# EAGLE design EurorackWizard (EAGLE 7.6.0)
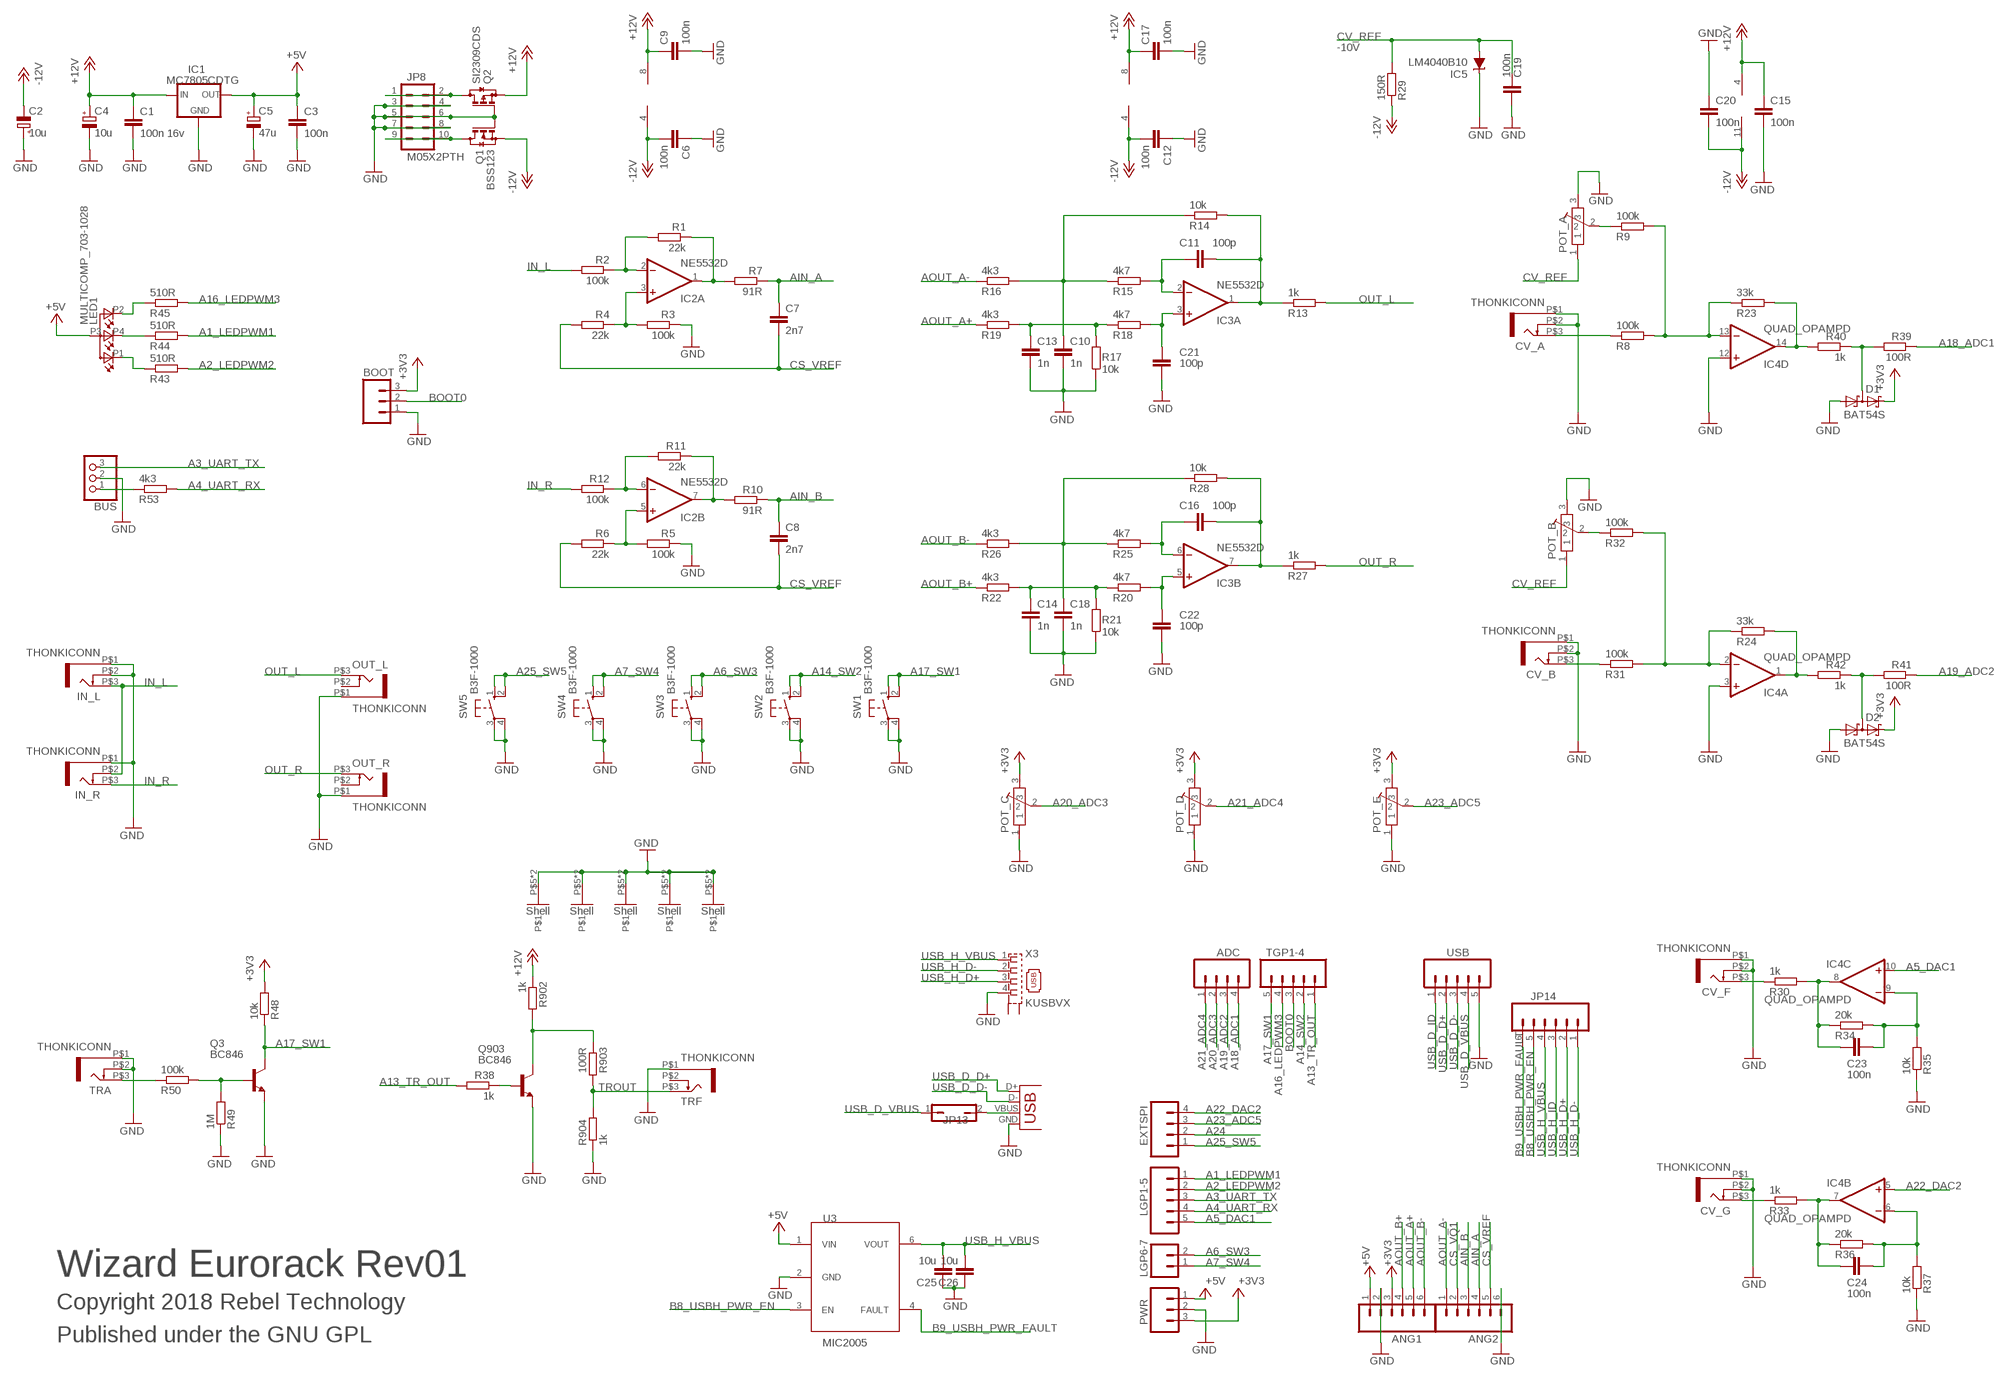
[diagram p0: schematic, sheet 1]

## Parts
ADC  M04PTH  [1X04]
ANG1  M06SIP  [1X06]
ANG2  M06SIP  [1X06]
BOOT  M03PTH  [1X03]
BUS  CON-JST-1X03PH-TH  [JST-B3B-PH-KL]
C1  100n 16v  C-EUC0603  [C0603]
C2  10u  CPOL-EU153CLV-0505  [CPOL-5]
C3  100n  C-EUC0603  [C0603]
C4  10u  CPOL-EU153CLV-0505  [CPOL-5]
C5  47u  CPOL-EUB  [PANASONIC_B]
C6  100n  C-EUC0603  [C0603]
C7  2n7  C-EUC0603  [C0603]
C8  2n7  C-EUC0603  [C0603]
C9  100n  C-EUC0603  [C0603]
C10  1n  C-EUC0603  [C0603]
C11  100p  C-EUC0603  [C0603]
C12  100n  C-EUC0603  [C0603]
C13  1n  C-EUC0603  [C0603]
C14  1n  C-EUC0603  [C0603]
C15  100n  C-EUC0603  [C0603]
C16  100p  C-EUC0603  [C0603]
C17  100n  C-EUC0603  [C0603]
C18  1n  C-EUC0603  [C0603]
C19  100n  C-EUC0603  [C0603]
C20  100n  C-EUC0603  [C0603]
C21  100p  C-EUC0603  [C0603]
C22  100p  C-EUC0603  [C0603]
C23  100n  C-EUC0603  [C0603]
C24  100n  C-EUC0603  [C0603]
C25  10u  C-EUC0603  [C0603]
C26  10u  C-EUC0603  [C0603]
CV_A  THONKICONN  [THONKICONN]
CV_B  THONKICONN  [THONKICONN]
CV_F  THONKICONN  [THONKICONN]
CV_G  THONKICONN  [THONKICONN]
D1  BAT54S  [SOT23]
D2  BAT54S  [SOT23]
EXTSPI  M04PTH  [1X04]
IC1  MC7805CDTG  MC78XX  [DPACK]
IC2  NE5532D  [SO08]
IC3  NE5532D  [SO08]
IC4  QUAD_OPAMPD  [SO14]
IC5  LM4040B10  LM4041C12DBZ  [DBZ_R-PDSO-G3]
IN_L  THONKICONN  [THONKICONN]
IN_R  THONKICONN  [THONKICONN]
JP8  M05X2PTH  [AVR_ICSP]
JP13  JP1Q  [JP1]
JP14  M06SIP  [1X06]
LED1  MULTICOMP_703-1028  [RGB-LED-703-1028]
LGP1-5  M05PTH  [1X05]
LGP6-7  M02PTH  [1X02]
OUT_L  THONKICONN  [THONKICONN]
OUT_R  THONKICONN  [THONKICONN]
POT_A  POT-ALPS-RK09L1140  [POT-ALPS-RK09L1140]
POT_B  POT-ALPS-RK09L1140  [POT-ALPS-RK09L1140]
POT_C  POT-ALPS-RK09L1140  [POT-ALPS-RK09L1140]
POT_D  POT-ALPS-RK09L1140  [POT-ALPS-RK09L1140]
POT_E  POT-ALPS-RK09L1140  [POT-ALPS-RK09L1140]
PWR  M03PTH  [1X03]
Q1  BSS123  [SOT23]
Q2  SI2309CDS  BSS84  [SOT23]
Q3  BC846  [SOT23]
Q903  BC846  [SOT23]
R1  22k  R-EU_0603  [0603]
R2  100k  R-EU_0603  [0603]
R3  100k  R-EU_0603  [0603]
R4  22k  R-EU_0603  [0603]
R5  100k  R-EU_0603  [0603]
R6  22k  R-EU_0603  [0603]
R7  91R  R-EU_0603  [0603]
R8  100k  R-EU_0603  [0603]
R9  100k  R-EU_0603  [0603]
R10  91R  R-EU_0603  [0603]
R11  22k  R-EU_0603  [0603]
R12  100k  R-EU_0603  [0603]
R13  1k  R-EU_0603  [0603]
R14  10k  R-EU_0603  [0603]
R15  4k7  R-EU_0603  [0603]
R16  4k3  R-EU_0603  [0603]
R17  10k  R-EU_0603  [0603]
R18  4k7  R-EU_0603  [0603]
R19  4k3  R-EU_0603  [0603]
R20  4k7  R-EU_0603  [0603]
R21  10k  R-EU_0603  [0603]
R22  4k3  R-EU_0603  [0603]
R23  33k  R-EU_0603  [0603]
R24  33k  R-EU_0603  [0603]
R25  4k7  R-EU_0603  [0603]
R26  4k3  R-EU_0603  [0603]
R27  1k  R-EU_0603  [0603]
R28  10k  R-EU_0603  [0603]
R29  150R  R-EU_0603  [0603]
R30  1k  R-EU_0603  [0603]
R31  100k  R-EU_0603  [0603]
R32  100k  R-EU_0603  [0603]
R33  1k  R-EU_0603  [0603]
R34  20k  R-EU_0603  [0603]
R35  10k  R-EU_0603  [0603]
R36  20k  R-EU_0603  [0603]
R37  10k  R-EU_0603  [0603]
R38  1k  R-EU_0603  [0603]
R39  100R  R-EU_0603  [0603]
R40  1k  R-EU_0603  [0603]
R41  100R  R-EU_0603  [0603]
R42  1k  R-EU_0603  [0603]
R43  510R  R-EU_0603  [0603]
R44  510R  R-EU_0603  [0603]
R45  510R  R-EU_0603  [0603]
R48  10k  R-EU_0603  [0603]
R49  1M  R-EU_0603  [0603]
R50  100k  R-EU_0603  [0603]
R53  4k3  R-EU_0603  [0603]
R902  1k  R-EU_0603  [0603]
R903  100R  R-EU_0603  [0603]
R904  1k  R-EU_0603  [0603]
SW1  B3F-1000  10-XX  [B3F-10XX]
SW2  B3F-1000  10-XX  [B3F-10XX]
SW3  B3F-1000  10-XX  [B3F-10XX]
SW4  B3F-1000  10-XX  [B3F-10XX]
SW5  B3F-1000  10-XX  [B3F-10XX]
TGP1-4  M05PTH  [1X05]
TRA  THONKICONN  [THONKICONN]
TRF  THONKICONN  [THONKICONN]
U3  MIC2005  [SOT23-6]
USB  M05PTH  [1X05]
X3  KUSBVX  [KUSBVX]
X5  USBPTH-VERTICAL  [USB-B-PTH-VERTICAL]

## Nets
+3V3: ANG1.3 BOOT.3 D1.2(C2) D2.2(C2) POT_C.3 POT_D.3 POT_E.3 PWR.3 R48.2
+5V: ANG1.1 C3.1 C5.+ IC1.3(OUT) LED1.P3(A) PWR.1 U3.1(VIN)
+12V: C1.1 C4.+ C9.1 C15.1 C17.1 IC1.1(IN) IC2.8(P:V+) IC3.8(P:V+) IC4.4(P:V+) Q2.2(S) R902.1
-12V: C2.- C6.2 C12.2 C20.2 IC2.4(P:V-) IC3.4(P:V-) IC4.11(P:V-) Q1.2(S) R29.1
A1_LEDPWM1: LGP1-5.1 R44.2
A2_LEDPWM2: LGP1-5.2 R43.2
A3_UART_TX: BUS.3 LGP1-5.3
A4_UART_RX: LGP1-5.4 R53.2
A5_DAC1: IC4.10(C:+IN) LGP1-5.5
A6_SW3: LGP6-7.2 SW3.1(S) SW3.2(S1)
A7_SW4: LGP6-7.1 SW4.1(S) SW4.2(S1)
A13_TR_OUT: R38.2 TGP1-4.1
A14_SW2: SW2.1(S) SW2.2(S1) TGP1-4.2
A16_LEDPWM3: R45.2 TGP1-4.4
A17_SW1: Q3.3(C) R48.1 SW1.1(S) SW1.2(S1) TGP1-4.5
A18_ADC1: ADC.4 R39.1
A19_ADC2: ADC.3 R41.1
A20_ADC3: ADC.2 POT_C.2
A21_ADC4: ADC.1 POT_D.2
A22_DAC2: EXTSPI.4 IC4.5(B:+IN)
A23_ADC5: EXTSPI.3 POT_E.2
A24: EXTSPI.2
A25_SW5: EXTSPI.1 SW5.1(S) SW5.2(S1)
AIN_A: ANG2.4 C7.1 R7.1
AIN_B: ANG2.3 C8.1 R10.1
AOUT_A+: ANG1.5 R19.1
AOUT_A-: ANG2.1 R16.1
AOUT_B+: ANG1.4 R22.1
AOUT_B-: ANG1.6 R26.1
B8_USBH_PWR_EN: JP14.5 U3.3(EN)
B9_USBH_PWR_FAULT: JP14.6 U3.4(FAULT)
BOOT0: BOOT.2 TGP1-4.3
CS_VQ1: ANG2.2
CS_VREF: ANG2.5 C7.2 C8.2 R4.2 R6.2
CV_REF: C19.1 IC5.2(A) POT_A.1 POT_B.1 R29.2
EXT_UART_RX: BUS.1 R53.1
GND: ANG1.2 ANG2.6 BOOT.1 BUS.2 C1.2 C2.+ C3.2 C4.- C5.- C6.1 C9.2 C10.2 C12.1 C13.2 C14.2 C15.2 C17.2 C18.2 C19.2 C20.1 C21.2 C22.2 C25.1 C26.1 CV_A.P$1 CV_A.P$2 CV_B.P$1 CV_B.P$2 CV_F.P$1 CV_F.P$2 CV_G.P$1 CV_G.P$2 D1.1(A1) D2.1(A1) IC1.4(GND) IC4.3(A:+IN) IC4.12(D:+IN) IC5.1(C) IN_L.P$1 IN_L.P$2 IN_R.P$1 JP8.3 JP8.4 JP8.5 JP8.6 JP8.7 JP8.8 OUT_L.P$1 OUT_R.P$1 POT_A.3 POT_A.P$5 POT_A.P$6 POT_B.3 POT_B.P$5 POT_B.P$6 POT_C.1 POT_C.P$5 POT_C.P$6 POT_D.1 POT_D.P$5 POT_D.P$6 POT_E.1 POT_E.P$5 POT_E.P$6 PWR.2 Q1.1(G) Q2.1(G) Q3.2(E) Q903.2(E) R3.1 R5.1 R17.1 R21.1 R35.1 R37.1 R49.1 R904.1 SW1.3(P) SW1.4(P1) SW2.3(P) SW2.4(P1) SW3.3(P) SW3.4(P1) SW4.3(P) SW4.4(P1) SW5.3(P) SW5.4(P1) TRA.P$1 TRA.P$2 TRF.P$1 U3.2(GND) USB.5 X3.4 X5.GND
IN_L: IN_L.P$3 IN_R.P$2 R2.2
IN_R: IN_R.P$3 R12.2
N$1: IC2.1(A:OUT) R1.1 R7.2
N$2: IC2.3(A:+IN) R3.2 R4.1
N$3: CV_A.P$3 R8.1
N$4: IC2.5(B:+IN) R5.2 R6.1
N$5: IC2.6(B:-IN) R11.2 R12.1
N$6: CV_F.P$3 R30.1
N$7: C11.1 IC3.2(A:-IN) R15.2
N$8: JP8.9 JP8.10 Q1.3(D)
N$9: IC2.2(A:-IN) R1.2 R2.1
N$10: IC2.7(B:OUT) R10.2 R11.1
N$11: C21.1 IC3.3(A:+IN) R18.2
N$12: JP8.1 JP8.2 Q2.3(D)
N$13: IC4.13(D:-IN) R8.2 R9.2 R23.1
N$14: POT_A.2 R9.1
N$15: C13.1 R17.2 R18.1 R19.2
N$16: D1.3(C1A2) R39.2 R40.1
N$17: IC4.14(D:OUT) R23.2 R40.2
N$18: C16.2 IC3.7(B:OUT) R27.1 R28.2
N$19: CV_B.P$3 R31.1
N$20: IC4.2(A:-IN) R24.1 R31.2 R32.2
N$21: POT_B.2 R32.1
N$22: IC4.1(A:OUT) R24.2 R42.2
N$23: D2.3(C1A2) R41.2 R42.1
N$24: C18.1 R25.1 R26.2 R28.1
N$25: C23.2 IC4.8(C:OUT) R30.2 R34.1
N$26: C16.1 IC3.6(B:-IN) R25.2
N$27: JP13.2 X5.VBUS
N$28: CV_G.P$3 R33.1
N$29: C23.1 IC4.9(C:-IN) R34.2 R35.2
N$30: C22.1 IC3.5(B:+IN) R20.2
N$31: C24.2 IC4.7(B:OUT) R33.2 R36.1
N$32: C14.1 R20.1 R21.2 R22.2
N$33: C24.1 IC4.6(B:-IN) R36.2 R37.2
N$37: Q3.1(B) R49.2 R50.2
N$39: C11.2 IC3.1(A:OUT) R13.1 R14.2
N$40: LED1.P1(CRED) R43.1
N$41: C10.1 R14.1 R15.1 R16.2
N$42: LED1.P2(CGREEN) R45.1
N$43: LED1.P4(CBLUE) R44.1
N$46: R50.1 TRA.P$3
N$47: Q903.1(B) R38.1
N$51: Q903.3(C) R902.2 R903.1
OUT_L: OUT_L.P$3 R13.2
OUT_R: OUT_R.P$3 R27.2
TROUT: R903.2 R904.2 TRF.P$3
USB_D_D+: USB.2 X5.D+
USB_D_D-: USB.3 X5.D-
USB_D_ID: USB.1
USB_D_VBUS: JP13.1 USB.4
USB_H_D+: JP14.2 X3.3
USB_H_D-: JP14.1 X3.2
USB_H_ID: JP14.3
USB_H_VBUS: C25.2 C26.2 JP14.4 U3.6(VOUT) X3.1
Unconnected: OUT_L.P$2 OUT_R.P$2 TRF.P$2 X3.M1(S1) X3.M2(S2)

## Notes on the sheet
- -10V
- Wizard Eurorack Rev01
- Copyright 2018 Rebel Technology
- Published under the GNU GPL

## Library data of the parts
ADC EXTSPI = SparkFun:M04: Header 4 Standard 4-pin 0.1" header. Use with straight break away headers (SKU : PRT-00116), right angle break away headers (PRT-00553), swiss pins (PRT-00743), machine pins (PRT-00117), and female headers (PRT-00115). Molex polarized connector foot print use with SKU : PRT-08231 with associated crimp pins and housings. 1MM SMD Version SKU: PRT-10208
ANG1 ANG2 JP14 = SparkFun:M06: Header 6 Standard 6-pin 0.1" header. Use with straight break away headers (SKU : PRT-00116), right angle break away headers (PRT-00553), swiss pins (PRT-00743), machine pins (PRT-00117), and female headers (PRT-00115). Molex polarized connector foot print use with SKU : PRT-08094 with associated crimp pins and housings. NOTES ON THE VARIANTS LOCK and LOCK_LONGPADS... This footprint was designed to help hold the alignment of a through-hole component (i.e. 6-pin header) while soldering it into place. You may notice that each hole has been shifted either up or down by 0.005 of an inch from it's more standard position (which is a perfectly straight line). This slight alteration caused the pins (the squares in the middle) to touch the edges of the holes. Because they are alternating, it causes a "brace" to hold the component in place. 0.005 has proven to be the perfect amount of "off-center" position when using our standard breakaway headers. Although looks a little odd when you look at the bare footprint, once you have a header in there, the alteration is very hard to notice. Also, if you push a header all the way into place, it is covered up entirely on the bottom side. This idea of altering the position of holes to aid alignment will be further integrated into the Sparkfun Library for other footprints. It can help hold any component with 3 or more connection pins.
BOOT PWR = SparkFun:M03: Header 3 Standard 3-pin 0.1" header. Use with straight break away headers (SKU : PRT-00116), right angle break away headers (PRT-00553), swiss pins (PRT-00743), machine pins (PRT-00117), and female headers (PRT-00115). Molex polarized connector foot print use with SKU : PRT-08232 with associated crimp pins and housings.
BUS = Rebel:CON-JST-1X03
C1 C3 C23 C24 = Rebel:C-EU: CAPACITOR, European symbol
C2 C4 = Rebel:CPOL-EU: POLARIZED CAPACITOR, European symbol
C5 = rcl:CPOL-EU: POLARIZED CAPACITOR, European symbol
C6-C22 C25 C26 = resistor:C-EU: CAPACITOR, European symbol
CV_A CV_B CV_F CV_G IN_L IN_R OUT_L OUT_R TRA TRF = Rebel:THONKICONN
D1 D2 = diode:BAT54S: Schottky Diodes Pin connection corrected 2011-05-04 Source: Fairchild .. BAT54.pdf
IC1 = James:MC78XX: VOLTAGE REGULATOR; OC_FARNELL: 2296028
IC2 IC3 = linear:NE5532: AUDIO AMPLIFIER
IC4 = adafruit:QUAD_OPAMP: OP AMP Standard quad package
IC5 = texas:LM4041: PRECISION MICROPOWER SHUNT VOLTAGE REFERENCE Source: http://focus.ti.com/lit/ds/slcs146e/slcs146e.pdf; MF: TEXAS INSTRUMENT CONNECTORS; MPN: LM4041C12QDBZT; OC_FARNELL: 1771733; OC_NEWARK: 43K3376
JP8 = SparkFun:M05X2: Header 5x2 Standard 10-pin dual row 0.1" header. Commonly used with AVR-ISP. Use with Spark Fun Electronics SKU: PRT-00778
JP13 = jumper:JP1Q: JUMPER
LED1 = Rebel:MULTICOMP_703-1028: Farnell: 2112143
LGP1-5 TGP1-4 USB = SparkFun:M05: Header 5 Standard 5-pin 0.1" header. Use with straight break away headers (SKU : PRT-00116), right angle break away headers (PRT-00553), swiss pins (PRT-00743), machine pins (PRT-00117), and female headers (PRT-00115). Molex polarized connector foot print use with SKU : PRT-08230 with associated crimp pins and housings.
LGP6-7 = SparkFun:M02: Header 2 Standard 2-pin 0.1" header. Use with straight break away headers (SKU : PRT-00116), right angle break away headers (PRT-00553), swiss pins (PRT-00743), machine pins (PRT-00117), and female headers (PRT-00115). Molex polarized connector foot print use with SKU : PRT-08233 with associated crimp pins and housings.
POT_A POT_B POT_C POT_D POT_E = Rebel:POT-ALPS-RK09L
Q1 = transistor-small-signal:BSS123: N-CHANNEL MOS FET; OC_FARNELL: 1843725
Q2 = transistor-small-signal:BSS84: P-CHANNEL MOS FET; OC_FARNELL: 1779264
Q3 Q903 = transistor:BC846: NPN TRANSISTOR
R1-R45 R48-R50 R53 R902-R904 = Rebel:R-EU_: RESISTOR, European symbol
SW1-SW5 = switch-omron:10-XX: OMRON SWITCH; MPN: B3F-1000; OC_FARNELL: 176432; OC_NEWARK: 36M3542
U3 = James:MIC2005; OC_FARNELL: 2509882
X3 = con-kycon:KUSBVX: Vertical,Top Entry Universal Serial Bus Connector KUSBVX Series Source: KYCON Sibalco USB vertical socket KUSBV.pdf
X5 = SparkFun:USB: USB Connectors USB-B-PTH is fully proven SKU : PRT-00139 USB-miniB is fully proven SKU : PRT-00587 USB-A-PCB is untested. USB-A-H is throughly reviewed, but untested. Spark Fun Electronics SKU : PRT-00437 USB-B-SMT is throughly reviewed, but untested. Needs silkscreen touching up. USB-A-S has not been used/tested USB-MB-H has not been used/tested

## Net classes
1 power: width 0.178 mm, drill 0.305 mm, clearance 0.178 mm to class 0, clearance 0.178 mm

## Board
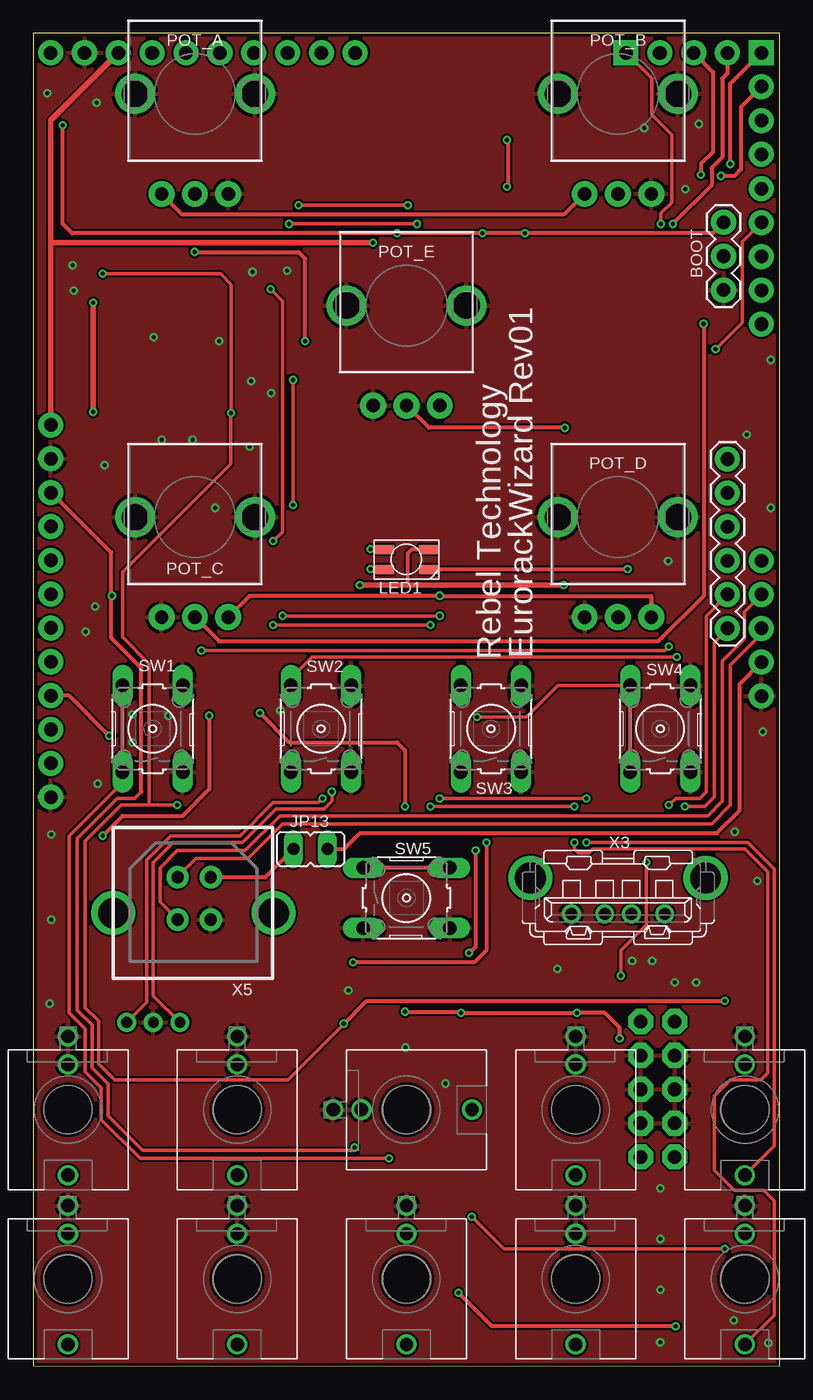
[diagram p1: board, top side]
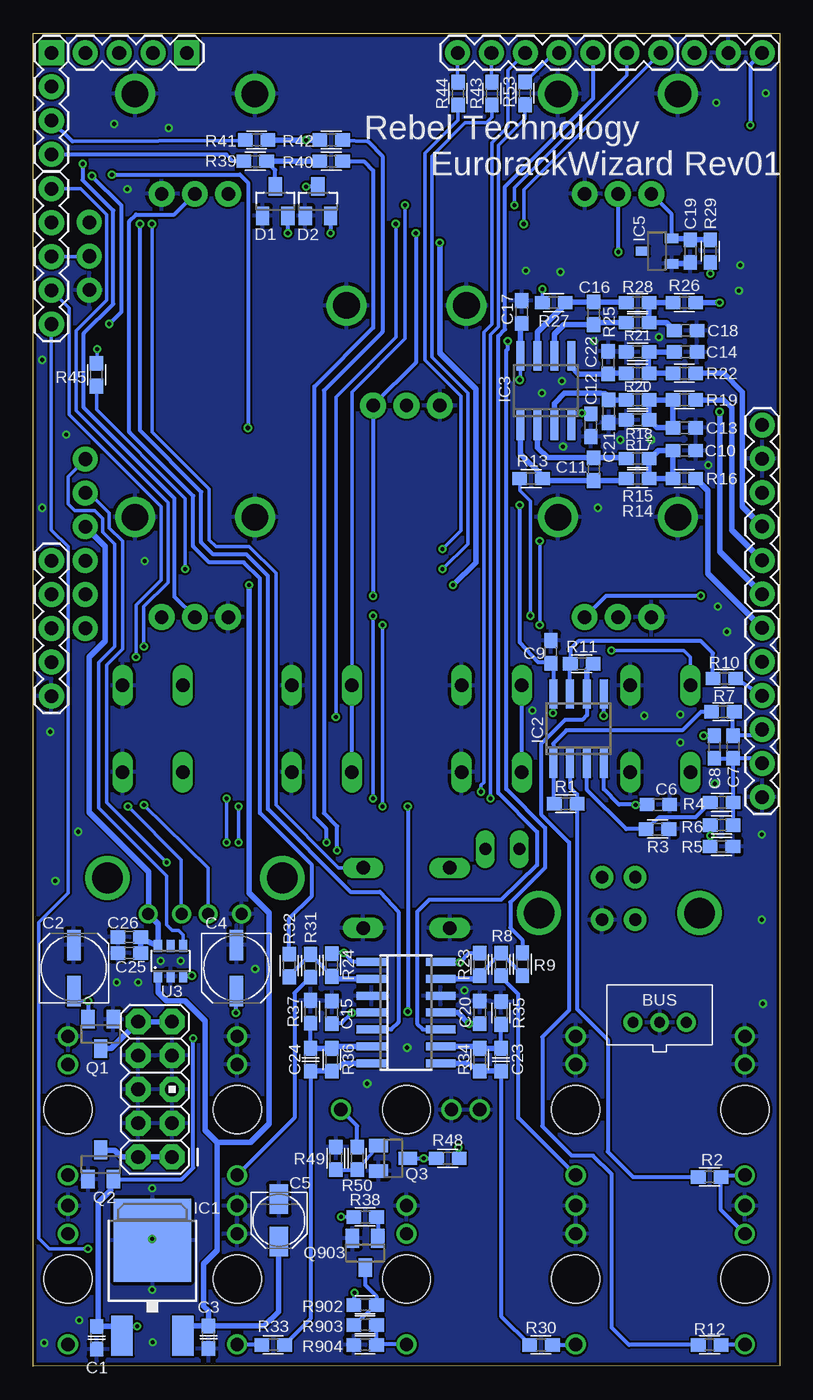
[diagram p2: board, bottom side, seen from below]

Size 56 x 100 mm. Coordinates in mm from the lower left corner, seen from the top.
Outline: 0,0.03 56,0 56,100 0,100 0,0.03
Copper layers (1*16): Top 0.035mm / dielectric 1.5mm / Bottom 0.035mm
Design rules "SeeedStudio_2layer_DRU_no_angle_20140221": minimum track width 6mil, minimum drill 12mil, track to track 6mil, track to pad 6mil, pad to pad 6mil, via to via 6mil, smd to smd 0mil, copper to edge 10mil, drill to drill 10mil, minimum pad ring 10mil, minimum via ring 6mil, stop-mask expansion 2mil, vias tented up to drill 100mil, thermal gap 10mil

### Footprints (pad centres in the part's own frame; a part is rotated, then mirrored left to right if it is on the bottom)
1X04 = drill 1.016 pad 1.88 square: 1 0,0 | drill 1.016 pad 1.88: 2 2.54,0; 3 5.08,0; 4 7.62,0
1X06 = drill 1.016 pad 1.88: 1 0,0; 2 2.54,0; 3 5.08,0; 4 7.62,0; 5 10.16,0; 6 12.7,0
1X03 = drill 1.016 pad 1.88: 1 0,0; 2 2.54,0; 3 5.08,0
JST-B3B-PH-KL = drill 0.8 pad 1.422: 1 2,0; 2 0,0; 3 -2,0
C0603 = smd 1.1 x 1: 1 -0.85,0; 2 0.85,0
CPOL-5 = smd 2.3 x 1: + 1.725,0; - -1.725,0
PANASONIC_B = smd 2.2 x 1.4: + 1.6,0; - -1.6,0
THONKICONN = drill 1: P$1 0,-5.5; P$2 0,-3.38; P$3 0,4.92 | hole 3.6: 0,0
SOT23 = smd 1 x 1.4: 1 -0.95,-1.1; 2 0.95,-1.1; 3 0,1.1
DPACK = smd 1.6 x 3: 1 -2.28,-4.8; 3 2.28,-4.8 | smd 5.8 x 6.2: 4 0,2.38
SO08 = smd 0.6 x 2.2: 1 -1.905,-2.6; 2 -0.635,-2.6; 3 0.635,-2.6; 4 1.905,-2.6; 5 1.905,2.6; 6 0.635,2.6; 7 -0.635,2.6; 8 -1.905,2.6
SO14 = smd 0.6 x 2.2: 1 -3.81,-2.6; 2 -2.54,-2.6; 3 -1.27,-2.6; 4 0,-2.6; 5 1.27,-2.6; 6 2.54,-2.6; 7 3.81,-2.6; 8 3.81,2.6; 9 2.54,2.6; 10 1.27,2.6; 11 0,2.6; 12 -1.27,2.6; 13 -2.54,2.6; 14 -3.81,2.6
DBZ_R-PDSO-G3 = smd 0.7 x 1: 1 -0.95,-1.1; 2 0.95,-1.1; 3 0,1.1
AVR_ICSP = drill 1.016 pad 1.88 octagon: 1 -1.27,5.08; 2 1.27,5.08; 3 -1.27,2.54; 4 1.27,2.54; 5 -1.27,0; 6 1.27,0; 7 -1.27,-2.54; 8 1.27,-2.54; 9 -1.27,-5.08; 10 1.27,-5.08
JP1 = drill 0.914 long: 1 0,-1.27; 2 0,1.27
RGB-LED-703-1028 = smd 0.7 x 1.4: P1 -0.75,1.65; P2 -0.75,-1.65; P3 0.75,-1.65; P4 0.75,1.65
1X05 = drill 1.016 pad 1.88: 1 0,0; 2 2.54,0; 3 5.08,0; 4 7.62,0; 5 10.16,0
1X02 = drill 1.016 pad 1.88: 1 0,0; 2 2.54,0
POT-ALPS-RK09L1140 = drill 1 pad 1.93: 1 -2.5,-7.5; 2 0,-7.5; 3 2.5,-7.5 | drill 2: P$5 -4.5,0; P$6 4.5,0
0603 = smd 1.1 x 1: 1 -0.85,0; 2 0.85,0
B3F-10XX = drill 1.016 long: 1 -3.251,2.261; 2 3.251,2.261; 3 -3.251,-2.261; 4 3.251,-2.261
SOT23-6 = smd 0.6 x 0.9: 1 -0.95,-1.15; 2 0,-1.15; 3 0.95,-1.15; 4 0.95,1.15; 5 0,1.15; 6 -0.95,1.15
KUSBVX = drill 0.9 pad 1.3: 1 3.5,0; 2 1,0; 3 -1,0; 4 -3.5,0 | drill 2.3 pad 2.8: M1 -6.57,2.71; M2 6.57,2.71
USB-B-PTH-VERTICAL = drill 0.914 pad 1.676: D+ 4.826,4.394; D- 4.826,7.595; GND 7.315,4.394; VBUS 7.315,7.595 | drill 2.286: P$1 0,4.902; P$2 12.04,4.902

### Placement (x,y rotation side)
ADC  54.64,98.54 270 bottom
ANG1  1.31,70.62 270 bottom
ANG2  1.31,55.39 270 bottom
BOOT  51.8,80.74 90 top
BUS  9,25.8 0 bottom
C1  51.24,2.13 270 bottom
C2  52.96,29.87 90 bottom
C3  42.86,2.17 270 bottom
C4  40.76,29.87 270 bottom
C5  37.57,10.94 270 bottom
C6  9.1,42.14 180 bottom
C7  3.5,46.46 270 bottom
C8  4.9,46.46 270 bottom
C9  17.16,53.6 90 bottom
C10  7.14,68.7 0 bottom
C11  13.94,67.3 270 bottom
C12  14.16,70.6 90 bottom
C13  7.14,70.4 0 bottom
C14  7.04,76.1 0 bottom
C15  33.6,26.54 90 bottom
C16  13.94,79 90 bottom
C17  19.34,79.1 90 bottom
C18  7.04,77.7 0 bottom
C19  6.7,83.66 270 bottom
C20  22.5,26.54 270 bottom
C21  12.82,71.64 270 bottom
C22  12.86,75.29 90 bottom
C23  20.9,23 270 bottom
C24  35.2,23 270 bottom
C25  48.8,31 0 bottom
C26  48.8,32.2 0 bottom
CV_A  15.3,19.25 180 top
CV_B  40.7,19.25 180 top
CV_F  15.3,6.55 180 top
CV_G  40.7,6.55 180 top
D1  37.84,87.4 0 bottom
D2  34.64,87.4 0 bottom
EXTSPI  44.48,98.54 180 bottom
IC1  47.06,7.07 0 bottom
IC2  15.08,47.83 0 bottom
IC3  17.54,73.2 0 bottom
IC4  28.03,26.53 270 bottom
IC5  9.2,83.66 90 bottom
IN_L  2.6,19.25 180 top
IN_R  2.6,6.55 180 top
JP8  46.86,20.77 180 bottom
JP13  20.8,38.8 90 top
JP14  52.1,55.36 90 top
LED1  28,60.52 90 top
LGP1-5  24.16,98.54 0 bottom
LGP6-7  8.92,98.54 180 bottom
OUT_L  53.4,19.25 180 top
OUT_R  53.4,6.55 180 top
POT_A  12.12,95.45 0 top
POT_B  43.88,95.45 0 top
POT_C  12.12,63.7 0 top
POT_D  43.88,63.7 0 top
POT_E  28,79.58 0 top
PWR  6.38,98.54 0 bottom
Q1  50.94,24.93 180 bottom
Q2  50.94,15.13 0 bottom
Q3  29,15.6 270 bottom
Q903  31.1,8.5 180 bottom
R1  16.04,42.2 0 bottom
R2  5.24,14.2 0 bottom
R3  9.16,40.3 180 bottom
R4  4.34,42.3 0 bottom
R5  4.36,39 180 bottom
R6  4.34,40.6 0 bottom
R7  4.24,49.1 180 bottom
R8  20.9,30.14 90 bottom
R9  19.3,30.16 270 bottom
R10  4.14,51.6 180 bottom
R11  14.84,52.7 0 bottom
R12  5.24,1.6 0 bottom
R13  18.64,66.6 180 bottom
R14  10.64,66.6 180 bottom
R15  10.64,68.1 180 bottom
R16  7.14,66.6 180 bottom
R17  10.64,71 0 bottom
R18  10.64,72.5 180 bottom
R19  7.14,72.5 180 bottom
R20  10.64,74.5 180 bottom
R21  10.64,76.1 0 bottom
R22  7.14,74.5 180 bottom
R23  22.5,30.14 90 bottom
R24  33.6,30.1 90 bottom
R25  10.64,78.3 180 bottom
R26  7.14,79.8 180 bottom
R27  16.94,79.8 180 bottom
R28  10.64,79.8 180 bottom
R29  5.2,83.66 90 bottom
R30  17.9,1.6 180 bottom
R31  35.2,30.04 90 bottom
R32  36.8,30.06 270 bottom
R33  38,1.6 0 bottom
R34  22.5,23 90 bottom
R35  20.9,26.5 270 bottom
R36  33.6,23 90 bottom
R37  35.2,26.6 270 bottom
R38  31.1,11.2 180 bottom
R39  39.34,90.4 0 bottom
R40  33.64,90.4 0 bottom
R41  39.24,92 0 bottom
R42  33.64,92 0 bottom
R43  21.58,95.48 90 bottom
R44  24.12,95.48 90 bottom
R45  51.26,74.38 90 bottom
R48  24.9,15.6 0 bottom
R49  33.3,15.6 270 bottom
R50  31.7,15.6 270 bottom
R53  19.1,95.5 90 bottom
R902  31.1,4.6 0 bottom
R903  31.1,3.1 0 bottom
R904  31.1,1.6 0 bottom
SW1  8.95,47.83 90 top
SW2  21.6,47.83 90 top
SW3  34.35,47.83 90 top
SW4  47.05,47.83 90 top
SW5  28,35.12 0 top
TGP1-4  54.64,78.18 90 bottom
TRA  28,19.25 270 top
TRF  28,6.55 180 top
U3  45.7,30.4 0 bottom
USB  54.64,60.44 270 bottom
X3  43.88,33.92 0 top
X5  6,29.1 0 top

### Tracks (layer width: path | path; a pad name or v marks a point on that pad's centre or on a via)
+3V3  (via drill 0.3)
  Top 0.254: v24.1,16.4 23.9,16.2 8.2,16.2 5.6,18.8 5.6,21.2 4.4,22.4 4.4,25.6 3.3,26.7 3.3,39.6 6.3,42.6 7.6,42.6 8.1,43.1
  Top 0.305: POT_D.3 46.38,57.8 v30.5,57.8 16.23,57.8 POT_C.3 | BOOT.3 50.98,85 v36.9,85 | v36.9,85 v36.89,85.01 | v36.9,85 v33.7,85 v27.3,85 2.9,85 2.2,85.7 v2.2,93.1 | ANG1.3 1.36,65.54 5.85,61.05 5.85,57.75 | 8.1,43.1 8.1,52.4 5.85,54.65 5.85,57.75 | v5.9,57.8 5.85,57.75
  Bottom 0.254: 37.1,86.31 D1.2 | R48.2 24.1,15.65 v24.1,16.4
  Bottom 0.305: v36.9,85 D1.2 | PWR.3 2.2,97.64 v2.2,93.1 | v27.3,85 27.3,75.3 30.5,72.1 POT_E.3 30.52,72.1 30.52,57.83 v30.5,57.8 | D2.2 v33.69,85.01 v33.7,85 | v5.9,57.8 13.03,57.8 POT_C.3
+5V  (via drill 0.3)
  Top 0.305: 28.1,58.6 28.1,61 28.4,61.3 29.62,61.3 LED1.P3
  Top 0.406: ANG1.1 1.31,84.3 | PWR.1 1.31,93.47 1.31,84.3 | v39.8,58.6 28.1,58.6 v24.5,58.6 | v25.5,84.3 1.31,84.3
  Bottom 0.406: C3.1 44.42,3.02 44.5,3.1 44.5,2.55 IC1.3 | C3.1 38.68,3.02 37.6,4.1 37.6,9.31 C5.+ | C3.1 42.86,4.16 43.2,4.5 43.2,7.7 42.2,8.7 42.2,16.8 | 42.2,16.8 43.1,17.7 43.1,25.9 44.6,27.4 46,27.4 46.65,28.05 U3.1 46.65,29.05 | 42.2,16.8 39.7,16.8 38.3,18.2 38.3,34 39.8,35.5 v39.8,58.6 | v25.5,84.3 25.5,76 22.8,73.3 22.8,60.3 v24.5,58.6
  Bottom 0.61: 45.12,1.93 IC1.3
+12V  (via drill 0.3)
  Top 0.254: v19.5,74 v19.5,64.6
  Top 0.305: v48.2,3 34.4,3 v31.9,5.5 | v17,49 19.2,46.8 27.3,46.8 27.9,46.2 v27.9,42 | v27.9,26.6 32,26.6 v32.1,26.5 v40.8,26.5 42.9,26.5 44,25.4 v44,24.6
  Bottom 0.254: IC3.8 19.45,74.06
  Bottom 0.305: R902.1 v31.9,5.5 | 51.14,3.08 51.06,3 v48.2,3 | v19.5,64.6 19.5,54.3 18.1,52.8 17.21,52.8 C9.1 16.98,52.58 IC2.8 16.98,49.02 v17,49 | 19.45,74.06 v19.5,74 | v27.9,42 v27.9,26.6 | IC4.4 32.07,26.53 v32.1,26.5 32.86,25.74 33.55,25.74 | v40.8,26.5 40.8,28.11 C4.+ | Q2.2 44.87,14.03 44,14.9 v44,24.6
  Bottom 0.406: C17.1 19.44,78.05 | IC3.8 19.45,76.35 19.44,78.05 | 19.44,77.3 19.44,78.05 | 33.65,25.84 C15.1 33.55,25.74 | IC1.1 49.4,2.33 49.4,2.9 49.48,2.98 C1.1 51.14,3.08 51.14,12.26 50.2,13.2 50.2,13.82 Q2.2
  Bottom 0.61: 49.02,1.95 IC1.1
-12V  (via drill 0.3)
  Top 0.254: 8.7,42.1 6.6,42.1 3.9,39.4 3.9,26.9 4.9,25.9 4.9,22.7 6.1,21.5 19.1,21.5 v23.3,25.7 | 8.7,42.1 v10.8,42.1 | 8.7,42.1 8.7,52.7 6.7,54.7 6.7,59.6 14.8,67.7 14.8,71.44 v14.84,71.5 14.84,81.16 14.04,81.96 v5.2,81.96
  Top 0.305: v23.3,25.7 25,27.4 v51.9,27.4
  Bottom 0.254: v10.8,42.1 9.99,42.1 C6.2 | 51.9,26 Q1.2
  Bottom 0.305: C6.2 12.04,42.14 13.2,43.3 13.2,45.2 IC2.4 | 51.9,26 v51.9,27.4 52.9,27.4
  Bottom 0.406: C12.2 14.79,71.45 | IC3.4 15.54,71.45 14.79,71.45 | v14.84,71.5 14.79,71.45 | R29.1 v5.2,81.96 | IC4.11 24.13,26.53 v23.3,25.7 C20.2 | Q1.2 51.89,26.39 | 52.9,27.4 52.9,28.09 C2.-
A1_LEDPWM1
  Bottom 0.254: R44.2 24.16,96.37 LGP1-5.1
A2_LEDPWM2
  Bottom 0.254: R43.2 21.62,96.37 LGP1-5.2
A3_UART_TX  (via drill 0.3)
  Top 0.254: BUS.3 9,27.8 9,37.8 10.5,39.3 15.7,39.3 18.2,41.8 21.8,41.8 22.4,42.4 v22.4,43.1
  Bottom 0.254: LGP1-5.3 20.4,97.22 20.4,93 21.6,91.8 21.6,78.2 22.2,77.6 22.2,43.8 22.4,43.6 v22.4,43.1
A4_UART_RX
  Bottom 0.254: 16.5,98.54 LGP1-5.4 16.91,98.54 R53.2
A5_DAC1
  Bottom 0.305: LGP1-5.5 14,95.1 20.6,88.5 20.6,77.8 21.1,77.3 21.1,43 18.2,40.1 18.2,37.6 20.9,35 26.3,35 27.2,34.1 27.2,25.7 26.76,25.26 IC4.10
A6_SW3  (via drill 0.3)
  Top 0.254: v19.9,87.1 v28.1,87.1
  Bottom 0.254: LGP6-7.2 11.46,96.84 19.9,88.4 v19.9,87.1 | v28.1,87.1 28.1,77.1 32.1,73.1 SW3.2
  Bottom 0.305: SW3.1 SW3.2
A7_SW4  (via drill 0.3)
  Top 0.254: SW4.2 39.38,51.08 37,48.7 v33.3,48.7 | v28.8,85.7 v19.2,85.7
  Top 0.305: SW4.1 SW4.2
  Bottom 0.254: LGP6-7.1 19.2,88.25 v19.2,85.7 | v33.3,48.7 33.3,72.7 28.8,77.2 v28.8,85.7
A13_TR_OUT  (via drill 0.3)
  Top 0.254: v32.9,11.2 35.3,8.8 v51.9,8.8
  Bottom 0.254: TGP1-4.1 54.64,62.74 53.4,61.5 53.4,35.5 55.6,33.3 55.6,9.6 54.8,8.8 v51.9,8.8 | v32.9,11.2 R38.2
A14_SW2  (via drill 0.3)
  Top 0.254: v48.3,53.2 20.9,53.2 19.4,51.7 19.4,51.14 SW2.2
  Bottom 0.254: TGP1-4.2 53.3,79.38 53.3,71.4 46.4,64.5 46.4,59 48.3,57.1 v48.3,53.2
  Bottom 0.305: SW2.1 SW2.2
A16_LEDPWM3  (via drill 0.3)
  Top 0.254: TGP1-4.4 53.2,84.36 53.2,78.3 v51.2,76.3
  Bottom 0.254: v51.2,76.3 51.2,75.23 R45.2
A17_SW1  (via drill 0.3)
  Top 0.254: v12.61,53.7 47.4,53.7 v47.7,54 | SW1.1 6.69,43.79 2.7,39.8 2.7,26.5 3.9,25.3 3.9,22.1 5.1,20.9 5.1,18.5 8,15.6 v26.7,15.6
  Top 0.305: SW1.1 SW1.2
  Bottom 0.254: v47.7,54 47.7,57 45.9,58.8 45.9,64.8 52.8,71.7 52.8,77.7 50.5,80 50.5,86.4 52.44,88.34 TGP1-4.5 | v12.61,53.7 7.2,53.7 6.7,53.2 SW1.2
  Bottom 0.305: Q3.3 v26.7,15.6 R48.1
A18_ADC1
  Bottom 0.254: 41.52,90.92 41,90.4 R39.1
  Bottom 0.305: ADC.4 41.52,90.92
A19_ADC2
  Bottom 0.305: ADC.3 53.08,91.9 R41.1
A20_ADC3  (via drill 0.3)
  Top 0.305: POT_C.2 13.93,54.4 46.9,54.4 50.3,57.8 v50.3,78.2 | ADC.2 53.1,94.46 53.1,89.8 52.6,89.3 v51.6,89.3
  Bottom 0.305: v51.6,89.3 49.4,87.1 49.4,79.1 v50.3,78.2
A21_ADC4  (via drill 0.3)
  Top 0.305: v52.3,90.2 52.3,96.2 ADC.1
  Bottom 0.305: POT_D.2 45.4,57.73 45.4,65.1 52.2,71.9 52.2,77.5 50,79.7 50,86.7 52.3,89 v52.3,90.2
A22_DAC2  (via drill 0.3)
  Top 0.305: EXTSPI.4 52.1,97 51.7,96.6 51.7,90.7 50.9,89.9 50.9,88.6 v48,85.7
  Bottom 0.305: IC4.5 29.14,25.26 28.6,25.8 28.6,34.1 30,35.6 32.2,35.6 38.4,41.8 38.4,59.3 40,60.9 42.5,60.9 43.4,61.8 43.4,65.6 48,70.2 v48,85.7
A23_ADC5  (via drill 0.3)
  Top 0.305: EXTSPI.3 51,97.09 51,91.1 50.1,90.2 v50.1,89.4 | v39.9,70.4 29.68,70.4 POT_E.2
  Bottom 0.305: v50.1,89.4 40.5,89.4 39.9,88.8 v39.9,70.4
A25_SW5  (via drill 0.3)
  Top 0.254: EXTSPI.1 46.4,96.61 46.4,93.9 47.9,92.4 47.9,87.3 47.1,86.5 v47.1,85.7
  Top 0.305: SW5.2 SW5.1
  Bottom 0.254: SW5.2 33.09,37.39 37.8,42.1 37.8,59.5 39.8,61.5 42.3,61.5 42.8,62 42.8,65.8 47.1,70.1 v47.1,85.7
AIN_A
  Bottom 0.305: ANG2.4 1.77,47.31 C7.1 3.49,49 R7.1
AIN_B  (via drill 0.3)
  Top 0.305: v5.7,47.3 2.69,50.31 ANG2.3
  Bottom 0.305: 2.1,50.31 ANG2.3 R10.1 | v5.7,47.3 C8.1
AOUT_A+
  Bottom 0.406: 1.28,60.46 ANG1.5 3.6,62.75 3.6,71.9 4.2,72.5 R19.1
AOUT_A-
  Bottom 0.406: ANG2.1 5.4,59.48 5.4,65.71 R16.1
AOUT_B+
  Bottom 0.406: 1.34,62.96 1.34,63 ANG1.4 2.8,64.49 2.8,73.1 4.2,74.5 R22.1
AOUT_B-  (via drill 0.3)
  Top 0.406: v4.5,71.6 v4.5,79.8
  Bottom 0.406: ANG1.6 4.5,61.11 v4.5,71.6 | v4.5,79.8 R26.1
B8_USBH_PWR_EN  (via drill 0.3)
  Top 0.254: v46,37.8 46,33.1 44.1,31.2 v44.1,29.3
  Bottom 0.254: JP14.5 51.82,65.52 50.3,64 50.3,62.9 49.3,61.9 49.3,53.8 50.5,52.6 50.5,42.3 47.5,39.3 47.25,39.05 v46,37.8 | U3.3 44.25,29.25 v44.1,29.3
B9_USBH_PWR_FAULT
  Bottom 0.254: U3.4 44.75,32.35 45.1,32.7 45.6,32.7 46,33.1 46,36.8 51.1,41.9 51.1,52.8 49.9,54 49.9,61.7 50.8,62.6 50.8,63.6 51.4,64.2 52.9,64.2 53.4,64.7 53.4,66.75 JP14.6
BOOT0
  Bottom 0.254: BOOT.2 51.82,83.26 TGP1-4.3
CS_VREF
  Bottom 0.305: C8.2 C7.2 | C7.2 R4.2 R6.2 | ANG2.5 1.69,45.61 C7.2
CV_REF
  Top 0.305: POT_B.1 39.83,86.4 11.18,86.4 POT_A.1
  Bottom 0.305: 6.7,84.61 C19.1 | IC5.2 8.1,86.42 POT_A.1
  Bottom 0.406: 6.8,84.41 arc90 C19.1 R29.2 | 6.7,84.61 IC5.2
EXT_UART_RX  (via drill 0.3)
  Top 0.254: BUS.1 8.5,27.3 8.5,38 10.3,39.8 15.5,39.8 18,42.3 21.4,42.3 v21.7,42.6
  Bottom 0.254: R53.1 19.1,93.6 21.1,91.6 21.1,78 21.7,77.4 v21.7,42.6
GND  (via drill 0.3)
  Bottom 0.305: 6.8,82.71 C19.2
  Bottom 0.406: IC5.1 6.8,82.71
  other vias: 17.84,73 10.14,48.8 16.44,82.1 18.54,49.2 47.07,9.54 47.07,5.74 5.34,67.6 9.64,69.5 11.94,69.5 16.24,69 16.34,73.9 9.04,77.2 13.94,76.9 52.57,3.44 47.07,13.34 3.94,55.1 4.64,57 7.44,48.9 7.44,46.8 4.84,43.7 1.34,39.9 1.24,27.2 1.34,33.5 23.64,28.2 55.17,1.74 54.74,47.6 52.64,40.1 54.34,36.4 49.74,28.8 47.04,1.8 48.14,28.8 44.94,30.4 46.44,30.4 13.64,64.4 1.04,95.5 4.74,94.8 2.94,82.6 3.04,80.7 19.04,82.2 49.94,93.2 45.84,92.9 48.94,88.3 53.54,69.9 55.34,75.5 55.34,64.4 47.64,60.4 39.34,29.8 30.94,21.2 27.94,23.9
  pour Bottom: -2.16,-0.97 -2.06,101.3 57.94,101.3 58.44,-1.47
  pour Top: -2.06,-0.97 -1.96,101.3 58.04,101.3 57.94,-0.97
IN_L
  Bottom 0.305: IN_L.P$3 4.39,14.33 R2.2 4.39,11.72 IN_R.P$2
IN_R
  Bottom 0.305: R12.2 4.39,1.63 IN_R.P$3
N$1
  Bottom 0.305: R7.2 5.9,49.1 7.3,47.7 16,47.7 16.98,46.72 IC2.1 16.98,42.3 R1.1
  Bottom 0.406: IC2.1 16.94,45.27
N$2
  Bottom 0.305: IC2.3 14.45,43.24 11.5,40.3 R3.2 9.01,41.2 6.29,41.2 R4.1
N$3
  Bottom 0.305: CV_A.P$3 19.6,18.63 19.6,27.9 20.8,29.1 R8.1
N$4  (via drill 0.3)
  Top 0.305: v13.2,48.8 13.2,43.3 11.2,41.3 6.7,41.3 v5.2,39.8
  Bottom 0.305: R5.2 5.19,39.02 v5.19,39.79 | v5.19,39.79 R6.1 | v5.19,39.79 v5.2,39.8 | v13.2,48.8 13.2,50.41 IC2.5
  Bottom 0.406: 13.14,50.4 IC2.5
N$5
  Bottom 0.305: R12.1 11.3,1.6 12.6,2.9 12.6,14.4 14,15.8 15.6,15.8 17.8,18 17.8,24.7 15.8,26.7 15.8,39.3 17.9,41.4 17.9,46.7 16.1,48.5 14.8,48.5 14.45,48.85 IC2.6
  Bottom 0.406: IC2.6 14.45,52.24 R11.2
N$6
  Bottom 0.305: R30.1 15.33,1.6 CV_F.P$3
N$7
  Bottom 0.406: R15.2 11.49,68.15 C11.1 17.39,68.15 18.18,68.94 IC3.2
N$8
  Bottom 0.406: JP8.9 JP8.10 50.15,23.83 Q1.3
N$9
  Bottom 0.305: R2.1 11,14.2 12.9,16.1 12.9,24.5 15.19,26.79 R1.2 15.2,42.9 15.71,43.41 IC2.2
N$10
  Bottom 0.305: IC2.7 15.71,52.67 R11.1 15.7,53.8 15.1,54.4 5.9,54.4 4.99,53.49 R10.2
N$11
  Bottom 0.406: R18.2 12.54,72.5 12.82,72.78 | IC3.3 16.91,72.23 16.14,73 13.44,73 13.12,72.98 12.82,72.78 | C21.1 12.82,72.78
N$12
  Bottom 0.406: JP8.1 JP8.2 49.39,15.69 49.9,16.2 50.91,16.2 Q2.3
N$13
  Bottom 0.254: 22.5,29.39 R23.1
  Bottom 0.305: 22.5,29.39 R8.2 19.3,29.39 R9.2
  Bottom 0.406: IC4.13 22.82,29.07 R23.1
N$14  (via drill 0.3)
  Top 0.305: v12.1,83.6 19.9,83.6 20.4,83.1 v20.4,76.9
  Bottom 0.305: POT_A.2 12.12,83.62 v12.1,83.6 | R9.1 19.3,32 20.2,32.9 20.2,34.8 17.6,37.4 17.6,40.4 20.5,43.3 20.5,76.2 20.4,76.3 v20.4,76.9
N$15
  Bottom 0.406: 8.04,72.5 R18.1 R17.2 9.19,70.4 C13.1 R19.2
N$16
  Bottom 0.305: D1.3 37.84,89.75 R39.2
  Bottom 0.406: R40.1 R39.2
N$17  (via drill 0.3)
  Top 0.305: v34,39.3 34,31.2 33.1,30.3 v24,30.3
  Bottom 0.305: R40.2 31.2,90.4 30.5,89.7 30.5,77.9 34.9,73.5 34.9,41.2 34,40.3 v34,39.3 | R23.2 23.31,30.99 v24,30.3 25.43,30.3 IC4.14
N$18
  Bottom 0.406: R28.2 11.54,79.85 C16.2 15.89,79.85 16.09,79.65 | IC3.7 18.18,77.56 16.09,79.65 | R27.1 16.09,79.65
N$19
  Bottom 0.305: R31.1 36.4,27.99 36.4,18.63 CV_B.P$3
N$20
  Bottom 0.305: R24.1 33.6,29.29 R31.2 36.8,29.29 R32.2
  Bottom 0.406: IC4.2 33.42,29.07 R24.1
N$21
  Bottom 0.305: R32.1 36.8,33.6 35.1,35.3 35.1,37.6 39,41.5 39,59.1 40.2,60.3 42.8,60.3 44,61.5 44,65.3 48.8,70.1 48.8,85.9 48.3,86.4 45.42,86.4 POT_B.2
N$22  (via drill 0.3)
  Top 0.305: v32.7,31 33.2,31.5 v33.2,38.7
  Bottom 0.305: IC4.1 32.04,30.34 v32.7,31 33.55,31 R24.2 33.6,31.05 | R42.2 30.9,91.9 29.8,90.8 29.8,77.6 34.2,73.2 34.2,41.5 33.2,40.5 v33.2,38.7
N$23  (via drill 0.3)
  Top 0.305: v35.54,92 35.6,91.9 35.6,88.5 v35.54,88.5
  Bottom 0.305: D2.3 v35.54,88.5
  Bottom 0.406: R42.1 v35.54,92 R41.2
N$24
  Bottom 0.406: R26.2 R28.1 R25.1 8.49,78.3 C18.1
N$25
  Bottom 0.305: C23.2 20.9,3.75 R30.2
  Bottom 0.406: C23.2 R34.1 23.45,22.75 24.02,22.72 IC4.8
N$26
  Bottom 0.406: IC3.6 16.91,77.44 16.19,78.15 C16.1 arc90 13.79,78.3 R25.2
N$27
  Top 0.305: X5.VBUS 17.43,36.7 JP13.2
N$28
  Bottom 0.305: CV_G.P$3 38.88,1.63 R33.1
N$29
  Bottom 0.305: C23.1 R35.2
  Bottom 0.406: IC4.9 22.74,23.99 R34.2 C23.1
N$30
  Bottom 0.406: 15.54,75 15.64,75 | IC3.5 15.54,75.7 15.54,75 | 15.54,75 15.54,74.9 15.08,74.44 C22.1 12.8,74.5 R20.2
N$31
  Bottom 0.305: C24.2 35.2,3.55 R33.2
  Bottom 0.406: IC4.7 32.08,22.72 32.65,22.75 R36.1 C24.2
N$32
  Bottom 0.406: 9.94,74.8 9.84,74.2 | 9.84,74.2 9.84,75.5 R21.2 C14.1 | 9.84,74.2 9.89,74.55 R20.1 R22.2
N$33
  Bottom 0.305: C24.1 R37.2
  Bottom 0.406: IC4.6 33.6,23.99 R36.2 C24.1
N$37
  Bottom 0.254: R50.2 Q3.1
  Bottom 0.305: R49.2 R50.2 | Q3.1 30.2,16.45
N$39
  Bottom 0.406: R14.2 11.49,66.45 C11.2 17.69,66.45 R13.1 17.74,66.6 17.74,66.8 19.44,68.45 19.44,70.5 IC3.1
N$40  (via drill 0.3)
  Top 0.254: v25.3,59.8 26.32,59.8 LED1.P1
  Bottom 0.254: R43.1 21.58,93.72 22,93.3 23.6,93.3 26.1,90.8 26.1,75.7 23.4,73 23.4,61.7 v25.3,59.8
N$41
  Bottom 0.406: 9.84,68.1 R15.1 R14.1 R16.2 C10.1 9.1,68.7 9.5,68.3
N$42  (via drill 0.3)
  Top 0.305: LED1.P2 29.65,59.8 v44.6,59.8
  Bottom 0.254: R45.1 51.26,71.76 44.6,65.1 44.6,59.9 arc-90 v44.6,59.8
N$43  (via drill 0.3)
  Top 0.305: LED1.P4 25.3,61.27 v25.3,61.3
  Bottom 0.254: v25.3,61.3 23.9,62.7 23.9,72.8 26.6,75.5 26.6,91 24.12,93.48 R44.1
N$46
  Bottom 0.305: R50.1 31.7,18.03 TRA.P$3
N$47
  Bottom 0.305: R38.1 30.15,11.1 Q903.1
N$51
  Bottom 0.305: R903.1 R902.2 30.25,5.25 31.1,6.1 Q903.3
OUT_L  (via drill 0.3)
  Top 0.254: v18.7,56.3 v30.5,56.3 | v30.5,42.6 v41.5,42.6 | v41.5,39.3 53.6,39.3 55.6,37.3 55.6,16.53 OUT_L.P$3
  Bottom 0.254: R13.2 19.49,65.69 18.7,64.9 v18.7,56.3 | v30.5,56.3 v30.5,42.6 | v41.5,42.6 v41.5,39.3
OUT_R  (via drill 0.3)
  Top 0.254: OUT_R.P$3 55.6,3.83 55.6,12.4 54.8,13.2 52.6,13.2 51.1,14.7 51.1,20.3 52.3,21.5 54.6,21.5 55.1,22 55.1,37.1 53.4,38.8 42,38.8 41.7,38.5 40.9,38.5 40.6,38.8 v40.6,39.3 | v40.6,42 v29.8,42 | v29.8,55.6 v18,55.6 | v18,61.9 18.7,62.6 18.7,79.9 v17.8,80.8
  Bottom 0.254: v40.6,39.3 v40.6,42 | v29.8,42 v29.8,55.6 | v18,55.6 v18,61.9 | v17.8,80.8 R27.2
TROUT
  Bottom 0.305: R903.2 R904.2 arc90 30.22,1.63 TRF.P$3
USB_D_D+
  Top 0.254: USB.2 53.34,56.6 53.34,54.54 51.7,52.9 51.7,42.4 50.6,41.3 18.5,41.3 15.9,38.7 10.8,38.7 9.5,37.4 9.5,34.82 X5.D+
USB_D_D-
  Top 0.254: USB.3 54.64,54.94 52.3,52.6 52.3,42.1 50.9,40.7 18.7,40.7 16.1,38.1 12.2,38.1 10.83,36.73
  Top 0.305: X5.D- 10.83,36.73
USB_D_VBUS
  Top 0.305: USB.4 53,51.18 53,41.7 51.3,40 24.5,40 23.3,38.8 JP13.1
USB_H_D+  (via drill 0.3)
  Top 0.254: JP14.2 50.5,56.3 50.5,43.1 50,42.6 48.2,42.6 v47.7,42.1
  Bottom 0.254: 42.9,33.95 X3.3 42.88,37.38 v47.7,42.1
USB_H_D-  (via drill 0.3)
  Top 0.254: 52.1,55.3 51.1,54.3 51.1,42.7 50.4,42 v48.9,42
  Top 0.406: JP14.1 52.1,55.3
  Bottom 0.254: v48.9,42 44.9,38 44.9,33.95 X3.2
USB_H_VBUS
  Bottom 0.406: X3.1 47.35,33.9 | X3.1 47.35,33.95 47.35,37.1 51.8,41.55 51.8,53.2 50.6,54.4 50.6,61.48 JP14.4 | C25.2 C26.2 47.9,32.05 U3.6 46.65,33.2 X3.1

### Text on the board
tPlace: Rebel Technology | EurorackWizard Rev01
bPlace: Rebel Technology | EurorackWizard Rev01